# Altium schematic sheet Audio Spectrogram.SchDoc
size A
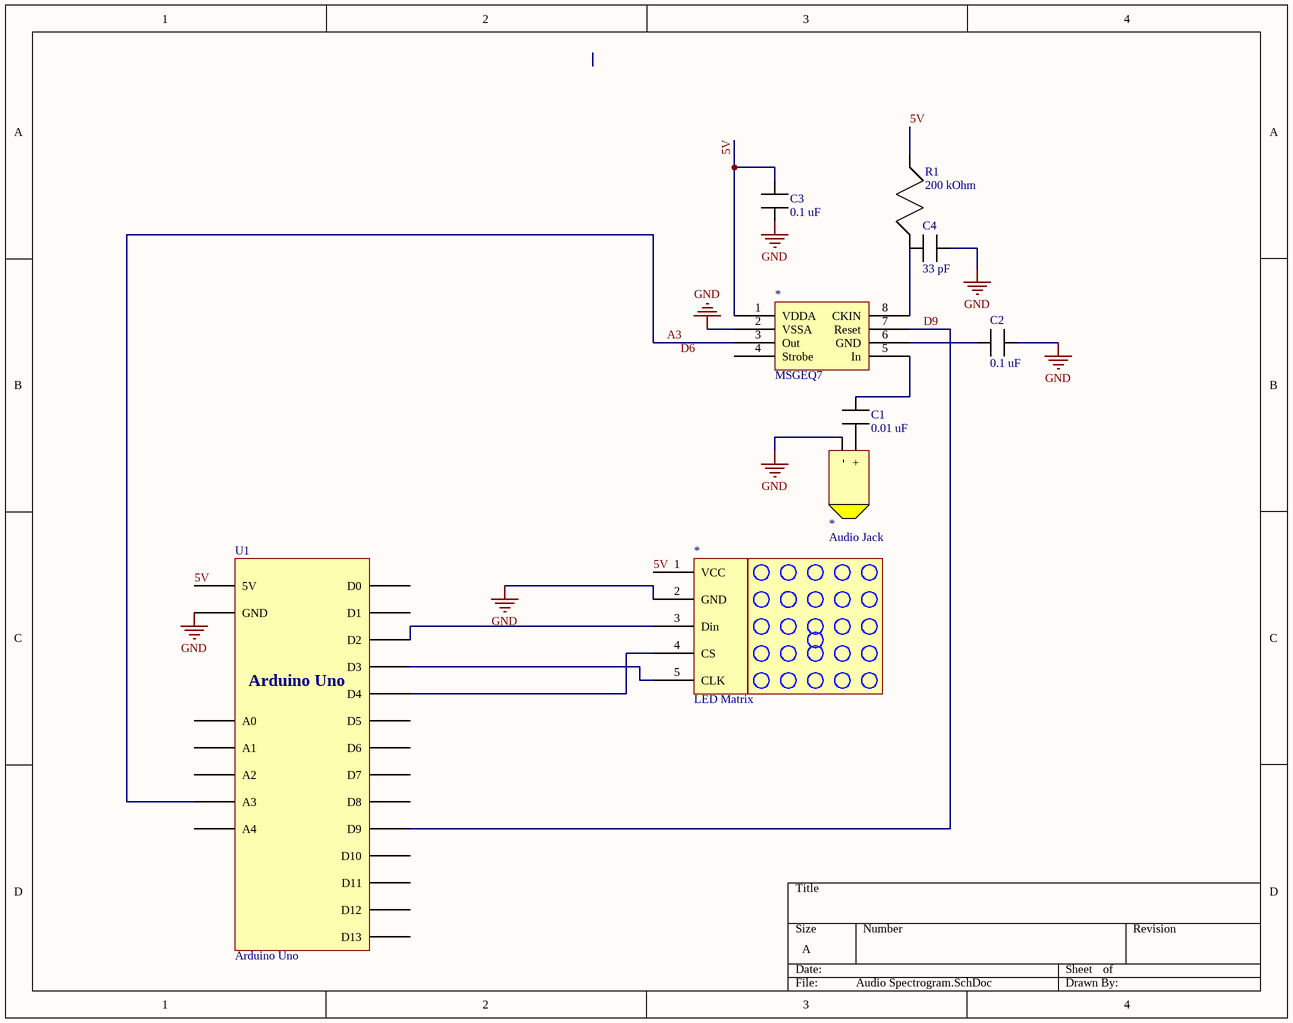
[diagram p0: Audio Spectrogram.SchDoc]

## Parts
(Parts that share a designator on the sheet are numbered #1, #2 ... from top to bottom, then left to right.)
*#1  MSGEQ7
*#2  Audio Jack
*#3  LED Matrix
C1  0.01 uF
C2  0.1 uF
C3  0.1 uF
C4  33 pF
R1  200 kOhm
U1  Arduino Uno

## Nets
GND: *#1.2(VSSA) *#2.2(-) *#3.2(GND) C2.57 C3.56 C4.57 U1.2(GND)
5V: *#1.1(VDDA) *#3.1(VCC) C3.57 U1.1(5V)
A3: *#1.3(Out) U1.5(A3)
D9: *#1.7(Reset) U1.16(D9)
Net*#1_5: *#1.5(In) C1.57
Net*#1_6: *#1.6(GND) C2.56
Net*#1_8: *#1.8(CKIN) C4.56
Net*#2_1: *#2.1(+) C1.56
Net*#3_3: *#3.3(Din) U1.9(D2)
Net*#3_4: *#3.4(CS) U1.11(D4)
Net*#3_5: *#3.5(CLK) U1.10(D3)

Not connected (* = marked no-connect by the designer): *#1 4(Strobe); R1 54 55; U1 3(A1) 4(A2) 6(A4) 7(D0) 8(D1) 12(D5) 13(D6) 14(D7) 15(D8) 17(D10) 18(D11) 19(D13)

## Notes on the sheet
- Labels drawn without touching a wire or pin: D6

## Library data of the parts
C1-C4 = Capacitor
R1 = Resistor